# EasyEDA Pro project CogletESP_2026-02-24.epro, board Grove - Vision AI Module V2
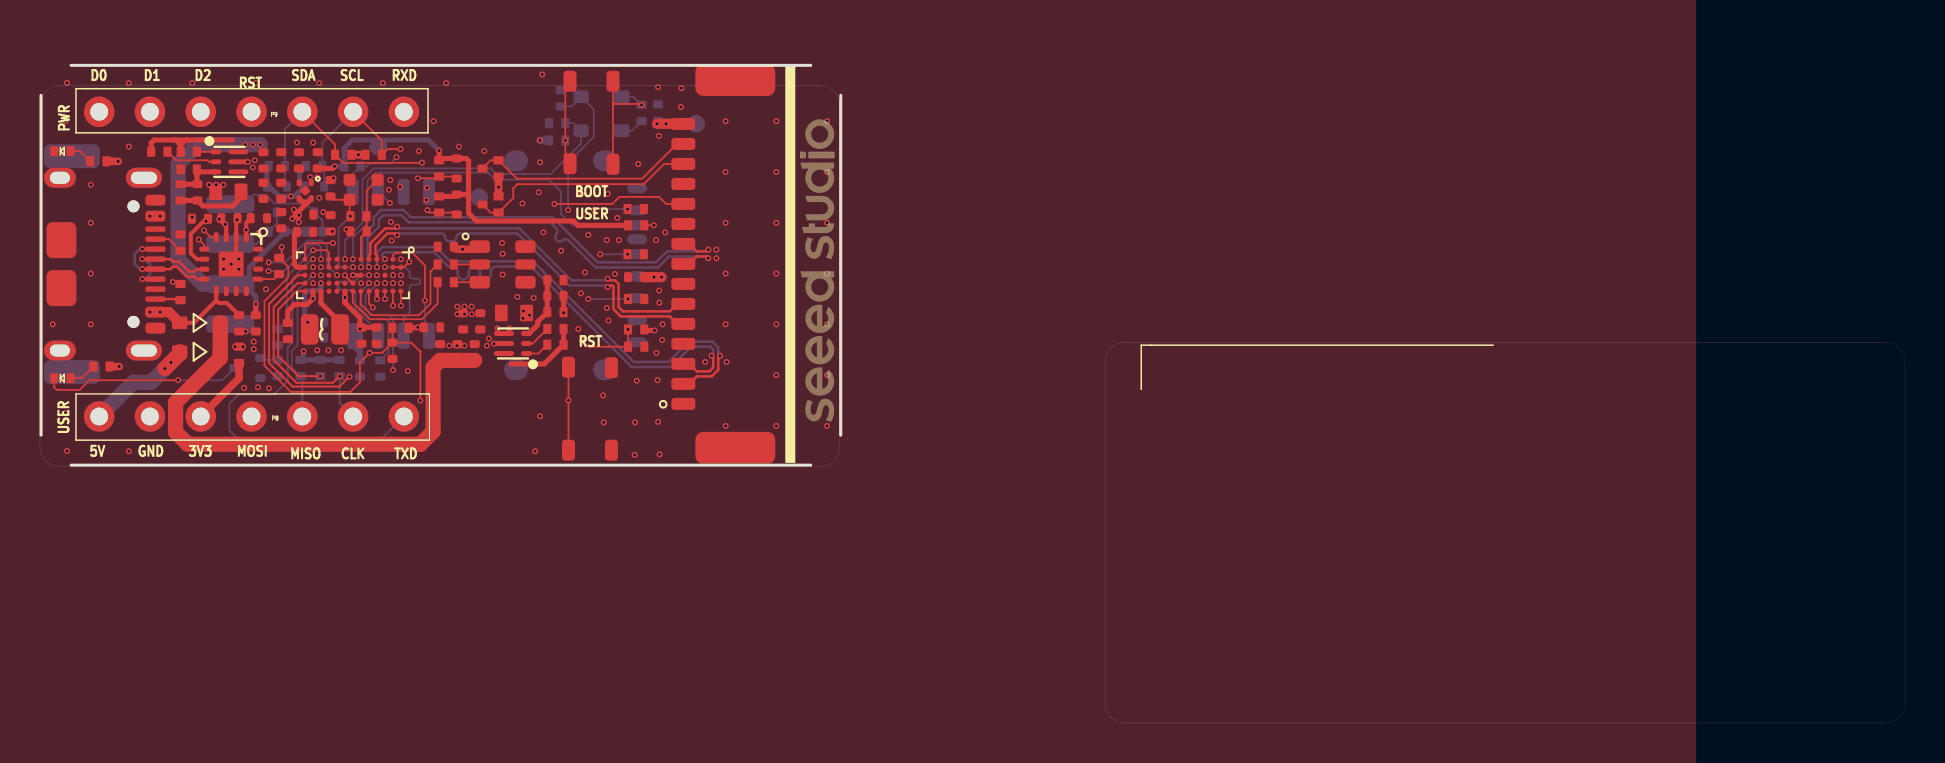
[diagram p3: board, top side]
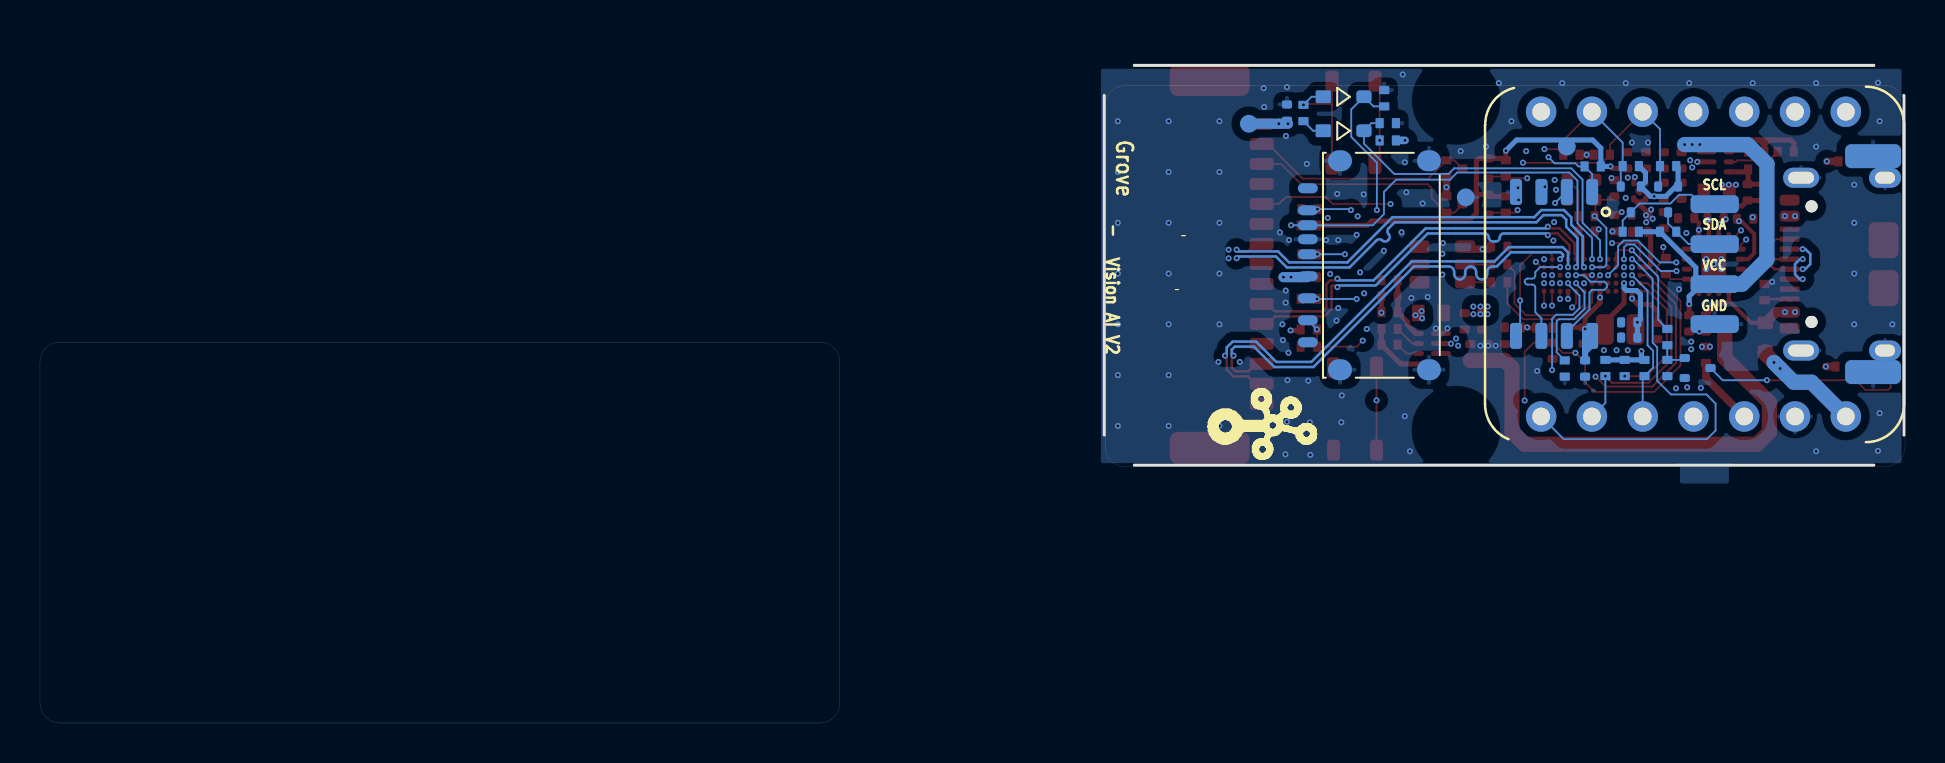
[diagram p4: board, bottom side, seen from below]

Outline 93.28 x 32.89 mm; copper layers: Top Layer, In1.Cu, In2.Cu, Bottom Layer. Coordinates in mm from the lower left corner of the outline.
Outline path: 0.05,31.39 0.05,14.4 ; 1.56,12.89 38.55,12.89 ; 38.55,32.89 1.56,32.89 ; 40.05,14.4 40.05,31.39 ; 0,30.88 0,13.83 arc(0.29,13.12) 1,12.83 39.01,12.83 arc(39.71,13.12) 40.01,13.83 40.01,30.88 arc(39.71,31.58) 39.01,31.88 1,31.88 arc(0.29,31.58) 0,30.88 ; 53.28,18.05 53.28,1 arc(53.57,0.29) 54.28,0 92.28,0 arc(92.99,0.29) 93.28,1 93.28,18.05 arc(92.99,18.76) 92.28,19.05 54.28,19.05 arc(53.57,18.76) 53.28,18.05
Stack: Top Layer 0.0009mm / dielectric 1 0.0025mm FR4 er 4.5 / In1.Cu 0.0001mm / dielectric 2 0.0229mm FR4 er 4.5 / In2.Cu 0.0001mm / dielectric 3 0.0025mm FR4 er 4.5 / Bottom Layer 0.0009mm

## Design rules (mm)
spacing safeClearance (default): track to track 0.076, other pairs 0.076 to 0.203
track width trackWidth (default): min 0.127, default 0.254, max 2.54
differential pair differentialPair (default): width min 0.127, default 0.254, max 2.54; gap min 0.152, default 0.152
via viaSize (default): diameter min 0.5, default 0.61, max 10; hole min 0.3, default 0.305, max 6
net VCC_3V3 uses CopperRegion11
net GND uses CopperRegion16
net GROVE_5V_IN uses CopperRegion6
net 1V8 uses CopperRegion7
net Net-(U6-LX) uses CopperRegion10
net Net-(U4-LX) uses CopperRegion13
net VBUS uses CopperRegion14
pour ie2233 uses CopperRegion6
pour ie2234 uses CopperRegion1
pour ie2235 uses CopperRegion14
pour ie2236 uses CopperRegion10
pour ie2237 uses CopperRegion
pour ie2238 uses CopperRegion13
pour ie2239 uses CopperRegion12
pour ie2240 uses CopperRegion7
pour ie2241 uses CopperRegion5
pour ie2242 uses CopperRegion9
pour ie2244 uses CopperRegion8
pour ie2246 uses CopperRegion11
pour ie2248 uses CopperRegion2
pour ie2249 uses CopperRegion3
pour ie2250 uses CopperRegion4
pour ie2251 uses CopperRegion15
pour ie2252 uses CopperRegion15
pour ie2253 uses CopperRegion16

## Placement (name value [footprint] x y rotation side)
BOOT1  SW_Push  [MLCCs:SW_Push_1P1T_NO_Vertical_Wuerth_434133025816]  27.58 30.02 270 top
C1  1uF  [MLCCs:C0402]  9.47 25.25 0 top
C2  1uF  [MLCCs:C0402]  8 25.22 180 top
C3  10nF  [MLCCs:C0402]  17.63 18.62 270 top
C4  4.7uF  [MLCCs:C0402]  13.79 19.28 0 bottom
C5  100nF  [MLCCs:C0402]  30.91 30.53 90 bottom
C6  4.7uF  [MLCCs:C0402]  13.27 25.43 0 top
C7  4.7uF  [MLCCs:C0402]  13.79 20.04 0 bottom
C8  100nF  [MLCCs:C0402]  13.27 24.56 180 top
C9  4.7uF  [MLCCs:C0402]  20.02 18.54 90 top
C10  4.7uF  [MLCCs:C0402]  20.88 18.54 90 top
C11  10uF  [MLCCs:C0402]  22.02 20.09 90 top
C13  100nF  [MLCCs:C0402]  16.08 19.38 270 top
C14  12pF  [MLCCs:C0402]  14.54 26.75 90 top
C15  12pF  [MLCCs:C0402]  15.93 24.59 0 top
C16  220nF  [MLCCs:C0402]  11.96 22.86 270 top
C17  1uF  [MLCCs:C0402]  29.82 22.3 180 top
C18  1uF  [MLCCs:C0402]  10.8 19.99 270 top
C19  1uF  [MLCCs:C0402]  16 17.73 90 bottom
C20  100nF  [MLCCs:C0402]  16.84 19.38 270 top
C21  100nF  [MLCCs:C0402]  14.54 24.99 90 top
C22  100nF  [MLCCs:C0402]  12.4 19.6 270 top
C23  100nF  [MLCCs:C0402]  12.07 25.15 270 top
C24  100nF  [MLCCs:C0402]  21.16 20.09 90 top
C25  100nF  [MLCCs:C0402]  20.29 23.83 0 top
C26  100nF  [MLCCs:C0402]  19.61 19.79 0 top
C27  100nF  [MLCCs:C0402]  21.74 18.54 270 top
C28  4.7uF  [MLCCs:C0402]  13.89 28.14 90 top
C29  100nF  [MLCCs:C0402]  12.95 28.14 270 top
C30  100nF  [MLCCs:C0402]  9.96 19.99 90 top
C31  100nF  [MLCCs:C0402]  10.95 25.25 0 top
C32  100nF  [MLCCs:C0402]  25.78 21.36 0 top
C34  4.7uF  [MLCCs:C0402]  11.18 28.14 270 top
C35  100nF  [MLCCs:C0402]  12.07 28.14 90 top
C36  100nF  [MLCCs:C0402]  7.87 26.54 270 top
C37  10uF  [MLCCs:C0402]  11.18 26.62 270 top
C39  100nF  [MLCCs:C0402]  12.07 26.62 270 top
D1  B5819WS  [MLCCs:D0805_SOD323]  28.08 29.62 0 bottom
D2  B5819WS  [MLCCs:D0805_SOD323]  8 18.57 180 top
D3  B5819WS  [MLCCs:D0805_SOD323]  28.08 31.32 0 bottom
D4  B5819WS  [MLCCs:D0805_SOD323]  8 20.02 180 top
D5  DNP  [MLCCs:R0402]  29.79 25.7 180 top
D6  DNP  [MLCCs:R0402]  29.79 23.44 180 top
D7  DNP  [MLCCs:R0402]  29.82 21.21 180 top
D8  DNP  [MLCCs:R0402]  29.82 18.82 180 top
J1  USB_C_Receptacle_USB2.0  [MLCCs:USB2.0-TYPE-C]  2.07 22.95 270 top
J2  Conn_01x15_MountingPin  [MLCCs:FPC_DNC_15P_1.0mm]  34.78 22.96 90 top
J3  Conn_01x04_MountingPin  [MLCCs:4P-SMD-2.0mm-RIGHT]  8 22.95 270 bottom
J5  ST-TF-MR267  [Connector:SD-TF-MR267]  29.87 22.89 270 bottom
L1  VLS201610HBX-4R7M-1  [MLCCs:L0806]  14.25 19.69 180 top
L2  470nH  [MLCCs:L0603]  23.71 20.51 180 top
L3  470nH  [MLCCs:L0603]  9.42 26.57 0 top
LED1  Yellow  [MLCCs:LED0402]  1.12 17.25 0 top
LED2  Green  [MLCCs:LED0402]  1.12 28.6 0 top
M1  XIAO Connector/DNP  [MLCCs:XIAO_Socket]  10.58 22.95 180 bottom
MIC1  MSM261D3526H1CPM  [MLCCs:MIC6P-3.5X2.65X0.94MM]  23.14 22.94 90 top
Q1  CJ1012  [MLCCs:SOT523]  21.49 25.93 0 top
Q2  CJ1012  [MLCCs:SOT523]  21.49 27.74 0 top
Q3  CJ1012  [MLCCs:SOT523]  10.37 17.75 180 bottom
Q4  CJ1012  [MLCCs:SOT523]  13.72 26.19 270 bottom
Q5  CJ1012  [MLCCs:SOT523]  11.85 26.19 270 bottom
R1  2.2k  [MLCCs:R0402]  13.72 27.85 180 bottom
R2  5.1k  [MLCCs:R0402]  7.02 24.03 90 top
R3  5.1k  [MLCCs:R0402]  7.02 21.55 90 top
R4  2.2k  [MLCCs:R0402]  25.87 29.14 0 bottom
R5  10k  [MLCCs:R0402]  15.62 27.84 0 bottom
R6  100K  [MLCCs:R0402]  25.78 19.71 0 top
R7  10k  [MLCCs:R0402]  18.03 19.77 0 top
R8  10K  [MLCCs:R0402]  25.78 18.92 0 top
R9  DNP  [MLCCs:R0402]  13.03 17.75 270 bottom
R10  100k  [MLCCs:R0402]  17.02 17.73 270 bottom
R11  100k  [MLCCs:R0402]  26.05 31.25 90 bottom
R12  DNP  [MLCCs:R0402]  14.02 17.75 270 bottom
R13  2.2k  [MLCCs:R0402]  11.85 27.85 180 bottom
R14  2.2k  [MLCCs:R0402]  13.72 24.57 0 bottom
R15  2.2k  [MLCCs:R0402]  11.85 24.57 180 bottom
R16  100K  [MLCCs:R0402]  25.78 20.55 0 top
R17  DNP  [MLCCs:R0402]  16.69 28.42 0 top
R18  DNP  [MLCCs:R0402]  15.16 28.42 180 top
R19  2.2k  [MLCCs:R0402]  22.94 25.93 270 top
R20  2.2k  [MLCCs:R0402]  22.94 27.74 90 top
R21  2.2k  [MLCCs:R0402]  19.96 25.93 90 top
R22  2.2k  [MLCCs:R0402]  19.96 27.74 90 top
R23  10k  [MLCCs:R0402]  25.87 30 180 bottom
R24  10k  [MLCCs:R0402]  2.92 28.09 180 top
R25  DNP  [MLCCs:R0402]  29.82 24.89 0 top
R26  22K  [MLCCs:R0402]  25.78 22.15 180 top
R27  DNP  [MLCCs:R0402]  14.99 17.75 270 bottom
R28  DNP  [MLCCs:R0402]  29.82 19.69 180 top
R29  0R  [MLCCs:R0402]  20.29 22.94 180 top
R30  0R  [MLCCs:R0402]  20.29 22.05 180 top
R31  10K  [MLCCs:R0402]  7.44 28.58 180 top
R32  100K  [MLCCs:R0402]  5.97 28.58 180 top
R33  100K  [MLCCs:R0402]  7.04 26.54 270 top
R34  22K  [MLCCs:R0402]  7.44 27.69 0 top
R35  510k  [MLCCs:R0402]  15.93 25.35 0 top
R36  5.1k  [MLCCs:R0402]  30.09 30.51 270 bottom
R37  100k  [MLCCs:R0402]  11.89 17.75 270 bottom
R38  10K  [MLCCs:R0402]  3.07 17.83 0 top
R39  0R  [MLCCs:R0402]  9.96 18.42 270 top
R40  2.2k  [MLCCs:R0402]  11.89 19.3 270 bottom
REF**  -  [Logo:LOGO-SEEED-NEW-1_5X15MM]  39.7 15.07 90 top
REF**#2  -  [Logo:GROVE-SILK-SMALL]  34.97 17.08 270 bottom
RST1  SW_Push  [MLCCs:SW_Push_1P1T_NO_Vertical_Wuerth_434133025816]  27.51 15.72 90 top
TP1  Test Point  [Misc:TP-D35MIL]  32.82 29.97 90 bottom
TP2  Test Point  [Misc:TP-D35MIL]  16.92 28.83 90 bottom
TP3  Test Point  [Misc:TP-D35MIL]  21.97 26.29 90 bottom
U1  HX6538  [MLCCs:WLCSP65_5.6x2.3x0.56mm]  15.65 22.4 270 top
U2  CH343P  [MLCCs:QFN-16-EP_3x3mm_P0.5mm_EP1x1mm]  9.56 22.95 270 top
U3  SGM2036S-1.8XXDH4G/TR  [MLCCs:X2SON-4]  13.27 26.62 270 top
U4  SY80004DQD  [Ic:DFN6-0.5-1.5X1.5X0.65MM]  23.66 18.98 180 top
U5  W25Q128JWSIQ  [MLCCs:SOIC-8_5.23x5.23mm_P1.27mm]  17.55 22.96 270 bottom
U6  SY80004DQD  [Ic:DFN6-0.5-1.5X1.5X0.65MM]  9.47 28.07 0 top
X1  24MHz  [MLCCs:4P2016]  16.19 26.67 180 top

## Footprints (pads in the part's own frame, mm; a bottom-side part is the same pattern mirrored in y, then rotated)
Connector:SD-TF-MR267
  rrect 0.5x1 smd: G1(-2,0) T1(3.85,0) T2(2.75,0) T3(1.65,0) T4(0.55,0) T5(-0.55,0) T6(-1.3,0) T7(-2.75,0) T8(-3.85,0)
  rrect 1.05x1.2 smd: S1(-5.225,1.61) S2(-5.225,6.06) S3(5.225,6.06) S4(5.225,1.61)
Ic:DFN6-0.5-1.5X1.5X0.65MM
  rrect 0.55x0.25 smd: 1(-0.675,0.5) 2(-0.675,0) 3(-0.675,-0.5)
  rrect 1x0.25 smd: 4(0.45,-0.5) 5(0.45,0) 6(0.45,0.5)
Misc:TP-D35MIL
  rrect 0.889x0.889 smd: 1(0,0)
MLCCs:4P2016
  rrect 0.6x0.6 smd: 1(-0.7,-0.5) 2(0.7,-0.5) 3(0.7,0.5) 4(-0.7,0.5)
MLCCs:4P-SMD-2.0mm-RIGHT
  rrect 0.889x2.413 smd: 1(-3,-1.524) 2(-1,-1.524) 3(1,-1.524) 4(3,-1.524)
  rrect 1.2x2.8 smd: MP(-5.4,6.4) MP(5.4,6.4)
MLCCs:C0402
  rrect 0.406x0.508 smd: 1(-0.406,0) 2(0.406,0)
MLCCs:D0805_SOD323
  rrect 0.762x0.635 smd: 1(-1.016,0) 2(1.016,0)
MLCCs:FPC_DNC_15P_1.0mm
  rrect 0.6x1.2 smd: 1(-7,2.6) 2(-6,2.6) 3(-5,2.6) 4(-4,2.6) 5(-3,2.6) 6(-2,2.6) 7(-1,2.6) 8(0,2.6) 9(1,2.6) 10(2,2.6) 11(3,2.6) 12(4,2.6) 13(5,2.6) 14(6,2.6) 15(7,2.6)
  rrect 1.6x4 smd: MP(-9.2,0) MP(9.2,0)
MLCCs:L0603
  rrect 0.635x0.826 smd: 1(-0.635,0) 2(0.635,0)
MLCCs:L0806
  rrect 0.889x1.524 smd: 1(-0.762,0) 2(0.762,0)
MLCCs:LED0402
  rrect 0.406x0.508 smd: 1(-0.406,0) 2(0.406,0)
MLCCs:MIC6P-3.5X2.65X0.94MM
  rrect 0.635x1.016 smd: 1(0.889,1.143) 3(-0.889,1.143) 4(-0.889,-1.143) 6(0.889,-1.143)
  rrect 0.508x1.016 smd: 2(0,1.143) 5(0,-1.143)
MLCCs:QFN-16-EP_3x3mm_P0.5mm_EP1x1mm
  rrect 0.5x0.254 smd: 1(-1.35,0.75) 2(-1.35,0.25) 3(-1.35,-0.25) 4(-1.35,-0.75) 9(1.35,-0.75) 10(1.35,-0.25) 11(1.35,0.25) 12(1.35,0.75)
  rrect 0.254x0.5 smd: 5(-0.75,-1.35) 6(-0.25,-1.35) 7(0.25,-1.35) 8(0.75,-1.35) 13(0.75,1.35) 14(0.25,1.35) 15(-0.25,1.35) 16(-0.75,1.35)
  rrect 1.25x1.25 smd: 17(0,0)
MLCCs:R0402
  rrect 0.406x0.508 smd: 1(-0.406,0) 2(0.406,0)
MLCCs:SOIC-8_5.23x5.23mm_P1.27mm
  rrect 1.3x0.6 smd: 1(-3.6,1.905) 2(-3.6,0.635) 3(-3.6,-0.635) 4(-3.6,-1.905) 5(3.6,-1.905) 6(3.6,-0.635) 7(3.6,0.635) 8(3.6,1.905)
MLCCs:SOT523
  rrect 0.51x0.4 smd: 1(-0.645,0.5) 2(-0.645,-0.5) 3(0.645,0)
MLCCs:SW_Push_1P1T_NO_Vertical_Wuerth_434133025816
  rrect 1.05x0.65 smd: 1(-2.075,1.075) 1(2.075,1.075) 2(-2.075,-1.075) 2(2.05,-1.075)
MLCCs:USB2.0-TYPE-C
  round 0.6 hole 0.6: (-2.89,2.605) (2.89,2.605)
  rrect 0.55x1 smd: A1_B1_A12_B12(-3.2,3.7) A1_B1_A12_B12(3.2,3.7) A4_B4_A9_B9(-2.4,3.7) A4_B4_A9_B9(2.4,3.7)
  rrect 0.275x1 smd: A5(-1.25,3.7) A6(-0.25,3.7) A7(0.25,3.7) A8(1.25,3.7) B5(1.75,3.7) B6(0.75,3.7) B7(-0.75,3.7) B8(-1.75,3.7)
  oval 1x1.8 hole 0.6x1.3: S1(-4.32,3.125) S1(4.32,3.125)
  oval 1x1.6 hole 0.6x1: S1(-4.32,-1.075) S1(4.32,-1.075)
  rrect 1.8x1.5 smd: S1(-1.2,-1) S1(1.2,-1)
MLCCs:WLCSP65_5.6x2.3x0.56mm
  rrect 0.26x0.26 smd: A1(-0.8,2.4) A2(-0.4,2.4) A3(0,2.4) A4(0.4,2.4) A5(0.8,2.4) B1(-0.8,2) B2(-0.4,2) B3(0,2) B4(0.4,2) B5(0.8,2) C1(-0.8,1.6) C2(-0.4,1.6) C3(0,1.6) C4(0.4,1.6) C5(0.8,1.6) D1(-0.8,1.2) D2(-0.4,1.2) D3(0,1.2) D4(0.4,1.2) D5(0.8,1.2) E1(-0.8,0.8) E2(-0.4,0.8) E3(0,0.8) E4(0.4,0.8) E5(0.8,0.8) F1(-0.8,0.4) F2(-0.4,0.4) F3(0,0.4) F4(0.4,0.4) F5(0.8,0.4) G1(-0.8,0) G2(-0.4,0) G3(0,0) G4(0.4,0) G5(0.8,0) H1(-0.8,-0.4) H2(-0.4,-0.4) H3(0,-0.4) H4(0.4,-0.4) H5(0.8,-0.4) J1(-0.8,-0.8) J2(-0.4,-0.8) J3(0,-0.8) J4(0.4,-0.8) J5(0.8,-0.8) K1(-0.8,-1.2) K2(-0.4,-1.2) K3(0,-1.2) K4(0.4,-1.2) K5(0.8,-1.2) L1(-0.8,-1.6) L2(-0.4,-1.6) L3(0,-1.6) L4(0.4,-1.6) L5(0.8,-1.6) M1(-0.8,-2) M2(-0.4,-2) M3(0,-2) M4(0.4,-2) M5(0.8,-2) N1(-0.8,-2.4) N2(-0.4,-2.4) N3(0,-2.4) N4(0.4,-2.4) N5(0.8,-2.4)
MLCCs:X2SON-4
  rrect 0.35x0.254 smd: 1(-0.4,0.3) 2(-0.4,-0.3) 3(0.4,-0.3) 4(0.4,0.3)
  rrect 0.4x0.4 smd rot 45: T(0,0)
MLCCs:XIAO_Socket
  round 1.524 hole 0.889: 1(7.62,7.62) 2(5.08,7.62) 3(2.54,7.62) 4(0,7.62) 5(-2.54,7.62) 6(-5.08,7.62) 7(-7.62,7.62) 8(-7.62,-7.62) 9(-5.08,-7.62) 10(-2.54,-7.62) 11(0,-7.62) 12(2.54,-7.62) 13(5.08,-7.62) 14(7.62,-7.62)

## Nets
As in the schematic, except:
/0V9: C4.1 C7.1 L1.2 U1.L4
GND: C1.2 C2.2 C3.2 C4.2 C5.2 C6.2 C7.2 C8.1 C9.2 C10.2 C11.1 C13.2 C14.2 C15.1 C17.2 C18.2 C19.1 C20.2 C21.2 C22.2 C23.2 C24.1 C25.1 C26.2 C27.1 C28.2 C29.1 C30.1 C31.2 C34.2 C35.1 C37.1 C39.1 D5.1 D6.1 D7.1 D8.1 J1.A1_B1_A12_B12 J1.S1 J2.1 J2.4 J2.7 J2.10 J2.MP J3.4 J3.MP J5.S1 J5.S2 J5.S3 J5.S4 J5.T6 LED2.1 M1.13 MIC1.4 MIC1.5 MIC1.6 Q3.2 R2.2 R3.2 R10.2 R11.2 R23.2 R26.1 R34.1 R37.2 RST1.2 TP3.1 U1.C5 U1.G4 U1.H3 U1.L3 U1.M2 U1.M4 U2.2 U2.17 U3.2 U3.T U4.4 U5.4 U6.4 X1.2 X1.4

## Via types
v1: diameter 0.3, hole 0.15, Top Layer to Bottom Layer, 275 vias

## Routing (per net, layer and track width the routed paths; a pad name or vN(x,y) marks a point on that pad's centre or on a via; arc(x,y) is an arc through that point)
1V8: length 39.5
  Top Layer w0.203: 15.66,22.4 U1.F3
  Top Layer w0.254: 21.44,26.19 21.44,26.64 ; 21.44,26.19 21.44,26.32 21.33,26.43 ; 21.44,26.19 21.44,25.5 21.83,25.11 26.68,25.11 26.9,24.89 R25.1 ; 21.44,26.64 21.44,26.54 21.33,26.43 ; 21.44,26.64 21.44,28.12 21.32,28.24 21.11,28.24 ; 21.33,26.43 Q1.1 20.75,26.34 R21.2 ; C28.1 14.63,27.74 v1(14.73,27.84) ; 21.11,28.24 20.06,28.24 R22.2 ; 21.11,28.24 Q2.1 ; 19.96,28.08 R22.2 ; R22.2 v1(19.96,28.63) ; C20.1 C13.1 v1(16,19.71) 16,20.27 15.25,21.02 ; v1(15.25,21.28) 15.25,21.02 ; 15.25,21.02 U1.H5
  In1.Cu w0.305: 15.25,21.78 15.44,21.97 ; 15.25,21.78 v1(15.25,21.28) ; 15.25,21.78 15.06,21.97 14.88,21.97 ; 15.44,21.97 15.65,22.18 U1.G3 ; 15.44,21.97 14.88,21.97 ; 14.45,22.66 14.45,22.1 14.58,21.97 14.88,21.97 ; 14.45,22.66 14.45,23.17 ; 14.45,22.66 14.31,22.8 ; v1(14.63,24.59) 14.22,24.18 14.22,23.65 14.45,23.42 14.45,23.17 ; 14.45,23.17 14.45,22.94 14.31,22.8 ; 14.31,22.8 v1(14.05,22.8)
  In1.Cu w0.381: v1(14.63,24.59) 14.63,26.52 13.86,27.29 13.83,27.29 13.82,27.31 v1(13.51,27.31)
  Bottom Layer w0.254: v1(14.73,27.84) R5.1 15.21,28.75 15.62,29.16 19.43,29.16 v1(19.96,28.63) ; 16.01,19 U5.8
  Bottom Layer w0.305: 16,18.57 16,18.95 ; 16,18.57 C19.2 ; 16,18.57 15.65,18.92 U5.8 ; 16,18.57 v1(16,19.71)
  vias: v1(13.87,27.28) v1(15.65,22.4)
/0V9: length 3.4
  Bottom Layer w0.254: v1(14.05,22) 14.05,21.75 13.93,21.63 13.43,21.63 13.23,21.44 13.23,20.19 v1(13.39,20.04) 13.39,19.28
GND: length 3.1
  Top Layer w0.089: v1(17.25,21.21) U1.C5
  Top Layer w0.102: U1.H3 v1(15.25,22.39) 15.25,22.38 15.64,22 U1.G4
  Top Layer w0.203: C1.2 9.86,25.22 v1(9.86,25.17) 9.8,25.17 9.81,25.18 U2.2 9.81,23.2
  vias: v1(0.64,19.94) v1(1.27,30.1) v1(1.27,15.49) v1(1.35,32.02) v1(1.35,13.61) v1(2.54,26.92) v1(2.54,25.02) v1(2.54,22.48) v1(2.54,19.94) v1(4.45,32) v1(4.45,28.83) v1(4.45,13.59) v1(6.64,22.06) v1(7.62,32) v1(7.62,25.3) v1(9.18,23.2) v1(9.18,22.7) v1(9.56,22.95) v1(9.95,23.2) v1(9.95,22.7) v1(10.21,16.76) v1(10.29,19.58) v1(10.69,19.08) v1(10.69,18.69) v1(10.8,32) v1(10.93,24.51) v1(10.9,16.79) v1(11.3,21.69) v1(11.46,16.74) v1(12.85,29.03) v1(13.67,29.03) v1(13.65,22.8) v1(13.65,22) v1(13.87,18.64) v1(13.97,32) v1(13.97,26.26) v1(14.05,22.4) v1(14.17,25.55) v1(14.43,18.64) v1(14.68,27.25) v1(15.06,18.64) v1(15.32,24.69) v1(17.15,32) v1(17.45,26.67) v1(17.52,27.16) v1(17.55,25.05) v1(17.59,24.13) v1(18.4,17.61) v1(18.95,28.6) v1(19.36,26.77) v1(19.33,26.16) v1(19.69,30.1) v1(20.32,32) v1(20.47,18.87) v1(20.85,18.87) v1(20.95,28.83) v1(21.23,18.87) v1(22.23,28.6) v1(22.89,19.74) v1(23.11,24) v1(23.14,23.47) v1(23.14,22.43) v1(23.47,19.74) v1(23.88,21.31) v1(24.13,25.98) v1(24.69,21.26) v1(24.77,13.59) v1(24.94,26.54) v1(25.02,28.04) v1(25.02,15.34) v1(25.12,32.44) v1(25.18,24.54) v1(26.07,23.62) v1(26.92,19.71) v1(27.08,26.44) v1(27.05,21.49) v1(27.25,22.54) v1(27.38,25.34) v1(27.43,24.42) v1(28.17,16.38) v1(28.19,15.04) v1(28.35,24.16) v1(28.35,20.75) v1(28.4,26.47) v1(28.44,20.13) v1(28.75,22.46) v1(28.87,25.27) v1(28.96,24.16) v1(29.77,15.04) v1(29.74,13.41) v1(29.85,17.12) v1(29.92,27.97) v1(30.81,24.16) v1(30.84,18.52) v1(30.91,31.8) v1(30.96,29.36) v1(30.98,21.63) v1(30.98,21.02) v1(30.89,17.14) v1(30.91,15.06) v1(30.99,13.44) v1(31.14,19.94) v1(31.11,19.15) v1(31.27,24.54) v1(32.08,31.75) v1(32.05,30.81) v1(33.27,18.06) v1(33.83,23.67) v1(33.83,23.24) v1(34.29,30.1) v1(34.29,27.56) v1(34.29,25.02) v1(34.29,22.48) v1(34.29,19.94) v1(34.34,18.06) v1(34.29,14.86) v1(36.83,30.1) v1(36.83,27.56) v1(36.83,25.02) v1(36.83,22.48) v1(36.83,19.94) v1(36.83,17.4) v1(36.83,14.86) v1(39.37,30.1) v1(39.37,27.56) v1(39.37,25.02) v1(39.37,22.48) v1(39.37,19.94) v1(39.37,17.4) v1(39.37,14.86)
V33IO: length 6.5
  Top Layer w0.203: U2.1 v1(10.31,24.66) 10.31,25.02 C31.1 ; C2.1 8.38,25.09 8.31,25.22 7.54,24.46 7.54,23.5 7.84,23.2 U2.6
  In1.Cu w0.203: v1(8.31,25.09) 8.95,24.45 10.1,24.45 v1(10.31,24.66)
VBUS: length 6.7
  Top Layer w0.203: C30.2 9.35,21.01 8.94,21.01 8.81,21.13 ; 8.81,21.13 7.7,20.02 D4.2 ; 8.81,21.13 U2.9 ; U2.3 9.31,24.86 9.13,25.04
  Top Layer w0.508: v1(5.5,20.55) 6.45,20.55 D4.2
  vias: v1(5.5,25.35) v1(6.01,25.35) v1(6.01,20.55) v1(8.97,25.2) v1(9.27,24.94)
VCC_3V3: length 30
  Top Layer w0.203: v1(16.85,21.21) U1.D5
  Top Layer w0.254: L3.2 10.06,26.29 9.63,25.86 8.15,25.86 C36.2 R33.2 ; C8.2 12.73,24.43 12.73,22.94 12.87,22.8 U1.N2 ; U3.4 13.41,26.06 ; 13.41,26.06 12.86,25.51 ; 13.41,26.06 13.12,26.06 U3.3 ; 30.23,19.63 v1(30.73,19.63) ; R16.2 v1(26.19,20.52) C32.2 ; 12.86,25.51 C6.1 12.65,25.27 ; 12.86,25.51 12.7,25.63 ; C26.1 v1(18.9,19.79) 18.88,19.77 R7.2 ; U1.M5 v1(13.65,21.23) 13.36,20.94 12.73,20.94 12.4,20.61 C22.1 ; 12.12,25.53 12.17,25.58
  Top Layer w0.381: R20.1 v1(22.94,26.8) R19.1 ; MIC1.1 21.87,23.7 v1(21.13,23.7) 20.83,23.7 C25.2 ; R38.2 v1(3.96,17.83) ; R17.1 v1(15.93,28.42) R18.1 ; R24.1 v1(3.91,28.09)
  Top Layer w0.508: J2.15 32.17,29.97 v1(30.86,29.97) ; v1(31.09,22.3) v1(30.71,22.3) C17.1
  Bottom Layer w0.254: v1(13.18,18.59) 13.18,18.31 R9.1 R12.1 R27.1 ; 11.44,27.85 11.35,27.76 Q5.1 11.47,26.83 11.96,26.34 v1(12.55,26.34) 12.72,26.34 Q4.1 12.98,27.07 12.98,27.52 R1.2
  Bottom Layer w0.381: R4.1 v1(25.01,29.14)
  Bottom Layer w0.508: 32.79,29.97 v1(31.32,29.97) v1(30.86,29.97) ; J5.T4 29.91,22.3 v1(31.09,22.3)
  vias: v1(9.75,18.82) v1(10.16,18.82) v1(12.62,25.22) v1(12.7,25.68) v1(12.95,25.4) v1(12.94,25.04) v1(20.88,20.83) v1(20.88,20.45) v1(21.23,20.83) v1(21.23,20.45) v1(21.59,20.83) v1(21.59,20.45)
BOOTOPT0: length 21.8
  In1.Cu w0.089: v1(26.42,25.65) 26.42,23.34 24.87,21.79 19.48,21.79 18.85,21.16 17.83,21.16 17.5,21.49 16.28,21.49 16.05,21.72 v1(16.05,21.99)
  Bottom Layer w0.089: R11.1 26.58,30.84 D3.1 27.7,30.69 27.7,29.32 26.42,28.03 v1(26.42,25.65)
GROVE_5V_IN: length 26
  Top Layer w0.254: 6.66,29.16 5.72,29.16 5.56,29.01 R32.2 ; 6.66,29.16 6.78,29.16 7.04,28.91 ; 6.66,29.16 7.44,29.16 ; 7.04,28.91 7.19,29.06 7.29,29.16 7.44,29.16 ; 7.04,28.91 R31.2 ; v1(10.8,20.95) C18.1 ; 7.44,29.16 9.63,29.16
  Bottom Layer w0.254: J3.3 10.18,21.95 10.8,21.34 v1(10.8,20.95) ; R14.1 R15.1 10.47,22.78 10.47,22.35 10.06,21.95 9.39,21.95
  Bottom Layer w0.762: v1(11.02,28.93) 7.87,28.93 6.91,27.97 6.91,23.19 8.15,21.95 J3.3
  vias: v1(10.26,28.93) v1(10.64,28.93)
I2CS0_SCL{SLASH}5V: length 6
  Bottom Layer w0.089: 9.39,25.95 10.2,25.95 10.67,26.42 11.3,26.42 11.73,25.98 13.27,25.98 Q4.3 14.12,25.14 R14.2
I2CS0_SDA{SLASH}5V: length 3.7
  Bottom Layer w0.089: Q5.3 11.85,24.98 10.82,23.95 9.39,23.95 9.55,24.1
M_3V3_SCL: length 11.5
  Top Layer w0.089: J2.13 31.21,27.96 30.2,26.95 23.88,26.95 23.67,26.75 23.67,26.26 R19.2 22.54,25.53 Q1.3
M_3V3_SDA: length 11.3
  Top Layer w0.089: J2.14 31.86,28.96 30.12,27.23 23.85,27.23 R20.2 22.54,28.14 Q2.3
NET-(BOOT1-PAD2): length 4.3
  Top Layer w0.089: BOOT1.2 26.28,28.21 v1(26.28,29.14) 26.28,31.86 BOOT1.2
NET-(D1-A): length 1.2
  Bottom Layer w0.089: D1.2 29.6,29.62 R36.2
NET-(D2-K): length 29
  Top Layer w0.254: 23.57,17.96 25.22,17.96 R8.2 R6.2
  Top Layer w0.762: C27.2 C10.1 C9.1 19.66,17.78 19.66,14.58 19.02,13.94 7.39,13.94 6.78,14.55 6.78,16.03 9.02,18.26 D2.1 D4.1
NET-(D3-A): length 6.9
  Top Layer w0.089: 28.66,31.01 28.71,30.96 ; 28.66,31.01 28.66,32.22 ; 28.66,31.01 28.66,30.84 ; 28.71,30.96 30.04,30.96 v1(30.09,30.92) ; 28.71,30.96 28.66,30.91 28.66,30.84 ; 28.66,28.08 28.66,30.84
  Bottom Layer w0.089: D3.2 29.68,31.32 v1(30.09,30.92)
NET-(J1-CC1): length 1.5
  Top Layer w0.089: R2.1 6.45,24.2 J1.A5
NET-(J1-CC2): length 1.2
  Top Layer w0.127: J1.B5 6.97,21.2
NET-(LED1-A): length 1.4
  Top Layer w0.089: R38.1 2.08,17.25 LED1.2
NET-(LED1-K): length 10
  Top Layer w0.089: v1(6.91,17.14) 2.46,17.14 1.98,16.66 0.84,16.66 0.71,16.79 LED1.1
  Bottom Layer w0.089: v1(6.91,17.14) 9.12,17.14 Q3.3
NET-(LED2-A): length 1.2
  Top Layer w0.089: R24.2 2.01,28.6 LED2.2
NET-(M1-3V3): length 3.5
  Top Layer w0.381: 8.04,15.33 9.96,17.25 R39.2
NET-(MIC1-CLK): length 1.3
  Top Layer w0.089: R29.1 MIC1.2
NET-(MIC1-DATA): length 1.3
  Top Layer w0.089: MIC1.3 R30.1
NET-(Q3-G): length 1.8
  Bottom Layer w0.089: R37.1 R40.2 ; R37.1 11.11,18.16 Q3.1 ; R37.1 11.79,18.25
NET-(U1-TEST_MODE): length 5.2
  Bottom Layer w0.089: v1(16.45,22) 16.45,21.96 16.03,21.54 16.03,20.73 16.56,20.19 17.32,20.19 17.42,20.09 17.42,18.54 R10.1
NET-(U1-VX1): length 2.3
  Top Layer w0.254: L1.1 15.01,20.04 14.05,21 U1.L5
NET-(U1-XTAL_24M_I): length 5.3
  Top Layer w0.089: C14.1 14.7,26.17 X1.3 15.49,25.39 v1(15.53,25.35)
  Bottom Layer w0.089: v1(15.53,25.35) 14.94,24.76 14.94,22.91 15.05,22.8 v1(15.65,22.8)
NET-(U1-XTAL_24M_O): length 4.3
  Top Layer w0.089: U1.F1 16.05,24.3 C15.2 R35.2 16.34,26.62 X1.1
NET-(U2-RTS): length 1.2
  Top Layer w0.089: U2.13 11.71,22.2 C16.2
NET-(U4-EN): length 1.2
  Top Layer w0.089: U4.1 24.93,18.48 R8.1
NET-(U4-FB): length 3.2
  Top Layer w0.254: R26.2 C32.1 R16.1 24.89,20.07 24.89,19.91 24.46,19.48 U4.3
NET-(U4-LX): length 0.5
  Top Layer w0.254: U4.5 22.72,18.98 v1(22.71,18.97) 22.7,18.98
  vias: v1(22.35,18.87) v1(22.45,19.23) v1(24.18,20.6) v1(24.16,20.24) v1(24.49,20.4)
NET-(U4-PG): length 1.3
  Top Layer w0.089: U4.2 24.65,18.98 R6.1
NET-(U6-EN): length 1
  Top Layer w0.089: U6.1 7.86,28.57 R31.1
NET-(U6-FB): length 2.6
  Top Layer w0.254: R33.1 C36.1 7.85,26.97 R34.2 7.97,27.57 U6.3
NET-(U6-LX):
  vias: v1(8.46,26.92) v1(8.81,26.92) v1(9.17,26.92) v1(10.39,28.07) v1(10.64,27.79) v1(10.74,28.14)
NET-(U6-PG): length 2.6
  Top Layer w0.089: U6.2 8.46,28.07 8.38,28.14 6.81,28.14 R32.1
PA0{SLASH}3V3: length 31.6
  In1.Cu w0.089: v1(17.65,17.65) 7.65,17.65 5.97,19.33 4.12,19.33 3.43,20.02 3.43,30.1 M1.1
  Bottom Layer w0.089: v1(17.65,17.65) 17.65,20.22 17.45,20.42 16.61,20.42 16.28,20.75 16.28,21.38 16.85,21.95 v1(16.85,22)
PA1{SLASH}VMUTE{SLASH}3V3: length 19.1
  Top Layer w0.089: 25.73,25.96 v1(25.73,25.96) 28.62,25.96 28.97,26.31 30.96,26.31 31.32,25.96 J2.11
  In1.Cu w0.089: v1(25.73,25.96) 25.73,22.99 24.82,22.07 19.38,22.07 18.72,21.41 17.84,21.41 v1(17.25,22)
PA2{SLASH}I2CS0_SCL{SLASH}3V3: length 16.5
  Top Layer w0.089: v1(18.05,22) 18.06,22 ; M1.6 17.09,29.14 R17.2 17.37,28.7 v1(18.03,28.7)
  In1.Cu w0.089: v1(18.03,28.7) 19.66,27.08 19.66,23.11 18.54,22 v1(18.05,22)
  Bottom Layer w0.089: M1.6 14.12,29.03 R1.1 14.22,27.76 Q4.2
PA3{SLASH}I2CS0_SDA{SLASH}3V3: length 19.8
  Top Layer w0.089: v1(19.11,28.03) 19.1,28.02 15.16,28.02 R18.2 14.76,28.93 M1.5
  In1.Cu w0.089: v1(19.11,28.03) 19.94,27.2 19.94,23.01 18.62,21.69 17.93,21.69 17.65,21.97 v1(17.65,22)
  Bottom Layer w0.089: Q5.2 12.24,26.94 12.24,27.84 R13.1 12.25,29.7 M1.5
PB0{SLASH}RX0{SLASH}3V3: length 31.2
  Top Layer w0.089: v1(18.05,20.88) U1.A5 ; v1(8.2,24.64) 8.54,24.3 U2.4
  In1.Cu w0.089: v1(8.2,24.64) 7.8,24.64 7.47,24.31 7.47,18.36 7.87,17.96 21.64,17.96 22.01,18.33 22.01,19.24 22.45,19.69 22.45,21.21 22.07,21.59 20.22,21.59 19.33,20.7 18.22,20.7 v1(18.05,20.88)
PB1{SLASH}TX0{SLASH}3V3: length 29.4
  Top Layer w0.089: U1.B5 v1(17.65,20.88) ; v1(7.95,24.18) 8.21,23.91 U2.5
  In1.Cu w0.089: 17.65,20.87 18.1,20.43 19.41,20.43 20.37,21.39 21.89,21.39 22.23,21.06 22.23,19.79 21.78,19.34 21.78,18.43 21.54,18.19 8.05,18.19 7.75,18.49 7.75,23.98 v1(7.95,24.18)
PB2{SLASH}SSPIM_DO{SLASH}3V3: length 30
  Top Layer w0.102: v1(14.02,17.35) 12.93,17.35 11.91,18.36 11.91,20.68 12.83,21.6 U1.N5
  In1.Cu w0.089: 10.58,15.33 12.6,17.35 v1(14.02,17.35) 14.33,17.04 25.43,17.04 25.48,16.99 27.43,18.94 v1(27.43,21.21)
  Bottom Layer w0.089: J5.T3 29.87,21.23 29.9,21.21 v1(29.41,21.21) v1(27.43,21.21)
PB3{SLASH}SSPIM_DI{SLASH}3V3: length 32.9
  In1.Cu w0.089: 13.12,15.33 14.5,16.71 25.73,16.71 27.71,18.69 v1(27.71,25.65)
  Bottom Layer w0.089: 13.65,22.4 12.88,21.62 12.88,18.9 12.6,18.62 12.6,17.78 R9.2 13.12,17.26 13.12,15.33 ; 27.72,25.64 v1(27.71,25.65) 27.76,25.7 v1(29.39,25.7) 29.45,25.64 J5.T7
  vias: v1(13.65,22.4)
PB4{SLASH}SSPIM_SCLK{SLASH}3V3: length 31.9
  Top Layer w0.102: U1.N4 12.88,22 11.68,20.8 11.68,18.16 12.83,17.02 14.66,17.02 v1(14.99,17.35)
  In1.Cu w0.089: v1(28.02,23.44) 28.02,18.52 25.96,16.46 16.79,16.46 15.66,15.33
  Bottom Layer w0.089: 15.66,15.33 14.99,16.01 v1(14.99,17.35) ; v1(28.02,23.44) J5.T5 v1(29.39,23.44)
PB5{SLASH}SSPIM_~{CS}{SLASH}3V3: length 26.4
  Top Layer w0.089: v1(27.12,19.13) 27.43,18.82 D8.2 v1(29.41,19.69) 29.41,19.63
  Top Layer w0.102: v1(15.48,17.32) 15.47,17.32 14.97,16.83 12.64,16.83 11.46,18.01 11.46,20.95 12.9,22.4 U1.N3
  In1.Cu w0.102: v1(27.12,19.13) 27.12,19.12 25.32,17.32 v1(15.48,17.32)
  Bottom Layer w0.089: 29.41,19.69 J5.T2
PB6{SLASH}UART1_RX{SLASH}3V3: length 10.8
  Top Layer w0.089: v1(14.65,24) 13.39,24 13.25,23.87 U1.N1
  In1.Cu w0.089: v1(14.65,24) 15.04,24.39 15.04,28.45 15.65,29.06 16.69,29.06 M1.7
PB7{SLASH}UART1_TX{SLASH}3V3: length 20.7
  Bottom Layer w0.089: v1(13.65,23.2) 13.59,23.2 12.62,22.22 12.62,19.02 12.4,18.8 12.4,17.12 11.71,16.43 9.93,16.43 9.47,15.98 9.47,14.63 9.91,14.2 17.07,14.2 18.2,15.33
PB8{SLASH}3V3: length 14.8
  In1.Cu w0.089: v1(11.43,22.61) 11.76,22.94 11.76,29.11 11.28,29.59 9.02,29.59 M1.3
  Bottom Layer w0.089: v1(14.05,23.2) 14.05,23.79 13.92,23.93 13.54,23.93 12.22,22.61 v1(11.43,22.61)
PB9{SLASH}PDM_CLK{SLASH}3V3: length 6.7
  Top Layer w0.089: R29.2 19.53,22.58 19.53,20.98 18.95,20.4 16.59,20.4 16.05,20.93 U1.F5
PB10{SLASH}PDM_DATA0{SLASH}3V3: length 6.5
  Top Layer w0.089: R30.2 19.89,20.98 19.1,20.19 16.48,20.19 15.65,21.03 U1.G5
PB11{SLASH}3V3: length 17.7
  In1.Cu w0.089: M1.2 6.63,29.44 8.69,29.44 8.79,29.34 11.18,29.34 11.44,29.08 v1(11.44,23.04)
  Bottom Layer w0.089: v1(14.85,22.4) 14.35,22.9 14.35,23.85 14.07,24.13 13.36,24.13 12.27,23.04 11.44,23.04 v1(11.44,23.04)
QSPI_CLK: length 5.5
  Bottom Layer w0.089: v1(17.25,22.8) 18.24,22.8 18.49,22.56 18.49,22.38 arc(18.53,22.27) 18.64,22.23 18.87,22.23 arc(18.98,22.18) 19.02,22.08 arc(18.98,21.97) 18.87,21.93 18.64,21.93 arc(18.53,21.88) 18.49,21.78 18.49,20.55 18.19,20.24 U5.6
QSPI_CS: length 10.3
  Top Layer w0.089: v1(18.47,23.06) 18.2,22.8 18.05,22.8 U1.B2
  In1.Cu w0.089: v1(18.47,23.06) 18.77,23.37 18.77,26.9 18.47,27.2 18.47,27.91 18.09,28.3 17.83,28.3 v1(17.83,28.3)
  Bottom Layer w0.089: U5.1 15.65,27.46 R5.2 16.33,27.84 16.48,27.99 17.52,27.99 v1(17.83,28.3)
QSPI_D0: length 5.7
  Top Layer w0.089: U1.B1 17.65,23.39 17.78,23.52 18.62,23.52 19.25,22.89 19.25,21.14 v1(19.25,21.13)
  Bottom Layer w0.089: v1(19.25,21.13) 19.25,19.57 U5.5
QSPI_D1: length 6
  In1.Cu w0.089: v1(17.5,26.01) 18.24,25.27 18.24,23.8 17.76,23.32 17.76,22.91 17.25,22.4 v1(16.85,22.4)
  Bottom Layer w0.089: 16.92,26.09 U5.2 16.95,26.56 v1(17.5,26.01)
QSPI_D2: length 5.6
  In1.Cu w0.089: v1(18.01,26.82) 18.39,26.82 18.47,26.75 18.47,26.57 18.39,26.49 17.91,26.49 17.83,26.42 17.83,26.21 17.93,26.11 18.39,26.11 18.52,25.98 18.52,25.86 18.47,25.81 18.34,25.81 18.24,25.7 18.24,25.6 18.52,25.32 18.52,23.66 v1(18.05,23.2)
QSPI_D3: length 5.5
  Bottom Layer w0.089: U5.7 16.92,19.56 15.78,20.69 15.78,21.53 15.65,21.67 15.04,21.67 14.91,21.79 14.91,21.95 15.04,22.07 15.73,22.07 16.05,22.4 v1(16.45,22.4)
RST: length 53.5
  Top Layer w0.089: C3.1 17.12,18.52 v1(16.48,18.52) 16,18.03 16,17.04 15.52,16.56 12.55,16.56 11.23,17.88 11.23,21.1 12.42,22.3 12.42,22.81 C16.1 12.09,23.39 v1(12.09,23.8) ; C3.1 18.57,19.02 19.02,18.57 v1(19.02,16.13) ; C3.1 R7.1 ; 26.41,17.77 RST1.1 v1(26.43,16.14) 26.44,16.13 26.43,16.12 RST1.1 ; U1.E5 16.45,20.98 v1(16.65,20.79)
  In1.Cu w0.089: M1.4 10.68,30.57 12.09,29.16 v1(12.09,23.8) ; v1(16.65,20.79) 17.26,20.79 17.83,20.22 19.54,20.22 20.47,21.16 21.77,21.16 22,20.93 22,19.89 21.56,19.46 21.56,18.72 21.36,18.52 v1(16.48,18.52) ; v1(19.02,16.13) 26.42,16.13 v1(26.43,16.14)
RX_CK_N: length 22.5
  Top Layer w0.127: v1(33.43,23.25) 33.34,23.33 32.85,23.33 32.48,22.96 J2.8
  Bottom Layer w0.127: v1(33.43,23.25) 33.34,23.33 31.46,23.33 30.91,22.78 27.79,22.78 26.47,24.1 26.43,24.14 arc(26.29,24.2) 26.15,24.14 arc(26.01,24.08) 25.87,24.14 25.83,24.17 arc(25.77,24.31) 25.83,24.46 arc(25.89,24.6) 25.83,24.74 25.52,25.04 18.44,25.04 18.08,25.4 17.16,25.4 16.95,25.18 16.95,24.82 16.38,24.25 16.38,22.87 v1(16.45,22.8)
RX_CK_P: length 22.4
  Top Layer w0.127: v1(33.43,23.67) 33.34,23.59 32.85,23.59 32.48,23.96 J2.9
  Bottom Layer w0.127: v1(16.05,22.8) 16.13,22.87 16.13,24.36 16.69,24.92 16.69,25.29 17.06,25.65 18.19,25.65 18.54,25.3 25.63,25.3 27.89,23.04 30.81,23.04 31.36,23.59 33.34,23.59 v1(33.43,23.67)
RX_D0_N: length 24.1
  Top Layer w0.127: v1(34.01,18.37) 33.93,18.29 33.93,17.67 33.59,17.33 32.85,17.33 32.48,16.96 J2.2
  Bottom Layer w0.127: v1(34.01,18.37) 33.93,18.46 33.93,18.78 33.63,19.08 32.46,19.08 31.44,18.06 29.69,18.06 24.67,23.09 20.53,23.09 19.81,23.8 17.12,23.8 16.85,23.53 v1(16.85,22.8)
RX_D0_P: length 24.1
  Top Layer w0.127: J2.3 32.48,17.96 32.85,17.59 33.49,17.59 33.67,17.77 33.67,18.29 v1(33.59,18.37)
  Bottom Layer w0.127: v1(17.25,23.2) 17.11,23.34 17.11,23.43 17.22,23.55 19.71,23.55 20.42,22.83 20.62,22.83 arc(20.82,22.75) 20.9,22.56 20.9,22.46 arc(20.98,22.27) 21.18,22.18 arc(21.37,22.27) 21.45,22.46 21.45,22.56 arc(21.53,22.75) 21.73,22.83 arc(21.92,22.75) 22,22.56 22,22.46 arc(22.08,22.27) 22.27,22.18 arc(22.47,22.27) 22.55,22.46 22.55,22.56 arc(22.63,22.75) 22.83,22.83 24.56,22.83 29.59,17.81 31.55,17.81 32.56,18.82 33.53,18.82 33.67,18.68 33.67,18.46 v1(33.59,18.37)
RX_D1_N: length 19.5
  Top Layer w0.127: U1.D1 16.85,23.39 16.78,23.46 16.78,23.89 17.38,24.49 17.78,24.49 v1(17.87,24.4) ; v1(28.39,21.8) 28.48,21.88 28.63,21.88 28.68,21.83 28.68,20.7 29.05,20.33 31.5,20.33 31.88,19.96 J2.5
  Bottom Layer w0.127: v1(28.39,21.8) 28.3,21.88 26.48,21.88 23.87,24.49 21.02,24.49 arc(20.87,24.43) 20.82,24.29 arc(20.76,24.14) 20.62,24.09 20.47,24.09 arc(20.32,24.14) 20.27,24.29 arc(20.21,24.43) 20.07,24.49 17.95,24.49 v1(17.87,24.4)
RX_D1_P: length 19.5
  Top Layer w0.127: J2.6 31.88,20.96 31.5,20.59 29.15,20.59 28.94,20.8 28.94,21.96 28.76,22.14 28.48,22.14 v1(28.39,22.22) ; v1(17.87,24.83) 17.78,24.74 17.27,24.74 16.53,24 16.53,23.46 16.45,23.39 U1.E1
  Bottom Layer w0.127: v1(17.87,24.83) 17.95,24.74 23.98,24.74 26.58,22.14 28.3,22.14 v1(28.39,22.22)
SEN_D1{SLASH}SD~{INSERT}: length 21
  Top Layer w0.089: v1(30.71,24.89) 30.7,24.89 R25.2
  Bottom Layer w0.089: v1(15.65,23.2) 15.65,24.26 16.38,24.99 16.38,27.12 16.79,27.53 22.41,27.53 22.76,27.18 25.45,27.18 26.06,26.57 26.06,25.45 26.62,24.89 J5.G1 v1(30.71,24.89) 30.71,24.89
SEN_I2CM_SCL: length 5.7
  Top Layer w0.089: 18.04,22.37 18.05,22.38 v1(18.05,22.4) ; Q1.2 20.75,25.53 R21.1 19.5,25.53 v1(19.38,25.65)
  In1.Cu w0.089: v1(18.05,22.4) 18.51,22.4 19.38,23.27 19.38,25.65 v1(19.38,25.65)
SEN_I2CM_SDA: length 7.8
  Top Layer w0.089: Q2.2 20.75,27.33 R22.1 19.88,27.25 v1(18.9,27.25)
  In1.Cu w0.089: v1(17.65,22.4) 17.93,22.68 18.48,22.68 19.02,23.22 19.02,27.12 v1(18.9,27.25)
UD+: length 5.5
  Top Layer w0.127: v1(5.12,23.2) 6.52,23.2 6.64,23.08 6.95,23.08 7.45,22.58 7.72,22.58 7.84,22.7 U2.7 ; J1.B6 v1(5.12,22.2)
  Bottom Layer w0.127: v1(5.12,22.2) 5.26,22.2 5.5,22.44 5.5,22.95 5.25,23.2 v1(5.12,23.2)
UD-: length 5.5
  Top Layer w0.127: U2.8 7.84,22.2 7.72,22.32 7.34,22.32 6.84,22.82 6.64,22.82 6.52,22.7 v1(5.12,22.7) ; J1.B7 v1(5.12,23.7)
  Bottom Layer w0.127: v1(5.12,23.7) 4.98,23.7 4.74,23.46 4.74,22.95 4.99,22.7 v1(5.12,22.7)
USER_LED{SLASH}1V8: length 6.2
  Top Layer w0.089: U1.K2 14.45,23.2 14.45,23.52 14.33,23.65 v1(13.67,23.65)
  Bottom Layer w0.089: R40.1 12.34,20.17 12.34,22.33 v1(13.67,23.65)
USR_BTN{SLASH}1V8: length 17.8
  Bottom Layer w0.089: v1(15.25,23.2) 15.25,24.14 16.13,25.02 16.13,27.18 16.69,27.74 22.55,27.74 22.83,27.46 25.54,27.46 27.06,28.98 D1.1 26.68,30 R23.1
VMAIN: length 5.9
  Top Layer w0.762: D2.2 6.98,18.47 v1(6.25,17.73)
  Bottom Layer w0.762: v1(6.55,18.03) v1(6.25,17.73) 5.56,17.04 4.67,17.04 2.96,15.33

## Copper pours and planes (outline as drawn; the poured copper is in the pictures)
1V8 on Top Layer: 13.33,27.39 13.2,27.53 12.75,27.53 12.7,27.58 12.7,28.02 12.75,28.07 14.07,28.07 14.15,27.99 14.15,27.05 13.94,26.85 13.56,26.85 13.44,26.97
GND on Top Layer: 23.01,21.03 23.01,20.27 23.27,20.02 24.16,20.02 24.18,20.04 24.18,21.06 23.04,21.06
GND on Top Layer: 13.77,20.45 13.64,20.32 13.64,18.92 13.77,18.8 14.73,18.8 14.76,18.82 14.76,20.45
GND on Top Layer: 40.54,33.02 40.51,33.02 40.51,12.7 3.2,12.7 3.2,11.68 -0.13,11.68 -0.13,33.02 0.05,33.2
GND on Bottom Layer: -0.13,33.02 -0.13,12.7 8.51,12.7 8.51,11.68 11.56,11.68 11.56,12.7 40.51,12.7 40.51,33.02
GND on In1.Cu: 17.27,25.43 17.7,25.43 18.14,24.99 18.14,24 17.81,23.67 17.2,23.67 17.04,23.52 17.04,23.09 16.94,22.99 16.38,22.99 16.2,23.17 16.2,24.2 17.25,25.25 17.25,25.4
GND on In2.Cu: -0.13,33.02 -0.13,12.7 5.97,12.7 5.97,11.68 8.51,11.68 8.51,12.7 40.51,12.7 40.51,33.02
VBUS on In1.Cu: 9.13,24.81 8.4,25.54 6.44,25.54 4.87,23.97 4.87,21.94 5.78,21.02 6.29,21.02 6.29,20.26 5.02,20.26 3.72,21.55 3.72,24.35 5.96,26.58 9.59,26.58 10.3,25.87 10.3,25.11 10,24.81
VCC_3V3 on Top Layer: 9.75,26.97 10.47,26.97 10.82,26.62 12.78,26.62 13.16,26.24 13.39,26.24 13.59,26.44 13.67,26.44 13.72,26.39 13.72,26.06 13.21,25.55 13.21,24.28 13.11,24.18 12.57,24.18 12.4,24.36 12.4,25.17 12.34,25.22 11.79,25.22 11.71,25.3 11.71,25.78 11.63,25.86 9.75,25.86 9.63,25.98 9.63,26.85
VCC_3V3 on Top Layer: 23.22,21.44 23.39,21.26 23.39,20.19 23.29,20.09 22.48,20.09 22.33,20.24 20.85,20.24 20.68,20.42 20.68,21.31 20.8,21.44
VCC_3V3 on In1.Cu: -0.13,33.02 -0.13,12.7 3.18,12.7 3.2,12.73 3.2,11.68 5.97,11.68 5.97,12.7 40.51,12.7 40.51,33.02
GROVE_5V_IN on Top Layer: 9.42,28.55 9.42,29.21 9.55,29.34 12.17,29.34 12.32,29.18 12.32,28.45 12.22,28.35 11.02,28.35 10.92,28.45 9.58,28.45 9.6,28.47 9.5,28.47
NET-(D2-K) on Top Layer: 22.17,18.62 22.07,18.52 21.67,18.52 21.67,17.75 23.55,17.75 23.7,17.91 23.7,18.49 23.57,18.62
NET-(U4-LX) on In1.Cu: 23.85,19.38 24,19.53 24,20.7 24.08,20.78 24.56,20.78 24.64,20.7 24.64,19.3 24.05,18.72 22.3,18.72 22.17,18.85 22.17,19.18 22.38,19.38
NET-(U6-LX) on In1.Cu: 9.8,26.69 10.87,27.76 10.87,28.19 10.77,28.3 10.36,28.3 9.32,27.25 8.41,27.25 8.28,27.13 8.28,26.85 8.31,26.85 8.47,26.69

Small or netless copper shapes (teardrops, artwork), in the pictures only: 2 on Top Layer, 1 on In2.Cu

## Text on the board
Bottom Silkscreen Layer: SCL | SDA | VCC | GND | - | Vision AI V2 | Grove
Top Silkscreen Layer: P9 | P8 | 5V | GND | 3V3 | MOSI | MISO | CLK | TXD | RST | BOOT | USER | D0 | D1 | D2 | SDA | SCL | RXD | PWR
